# EAGLE schematic mega bootloader (EAGLE 7.6.0)
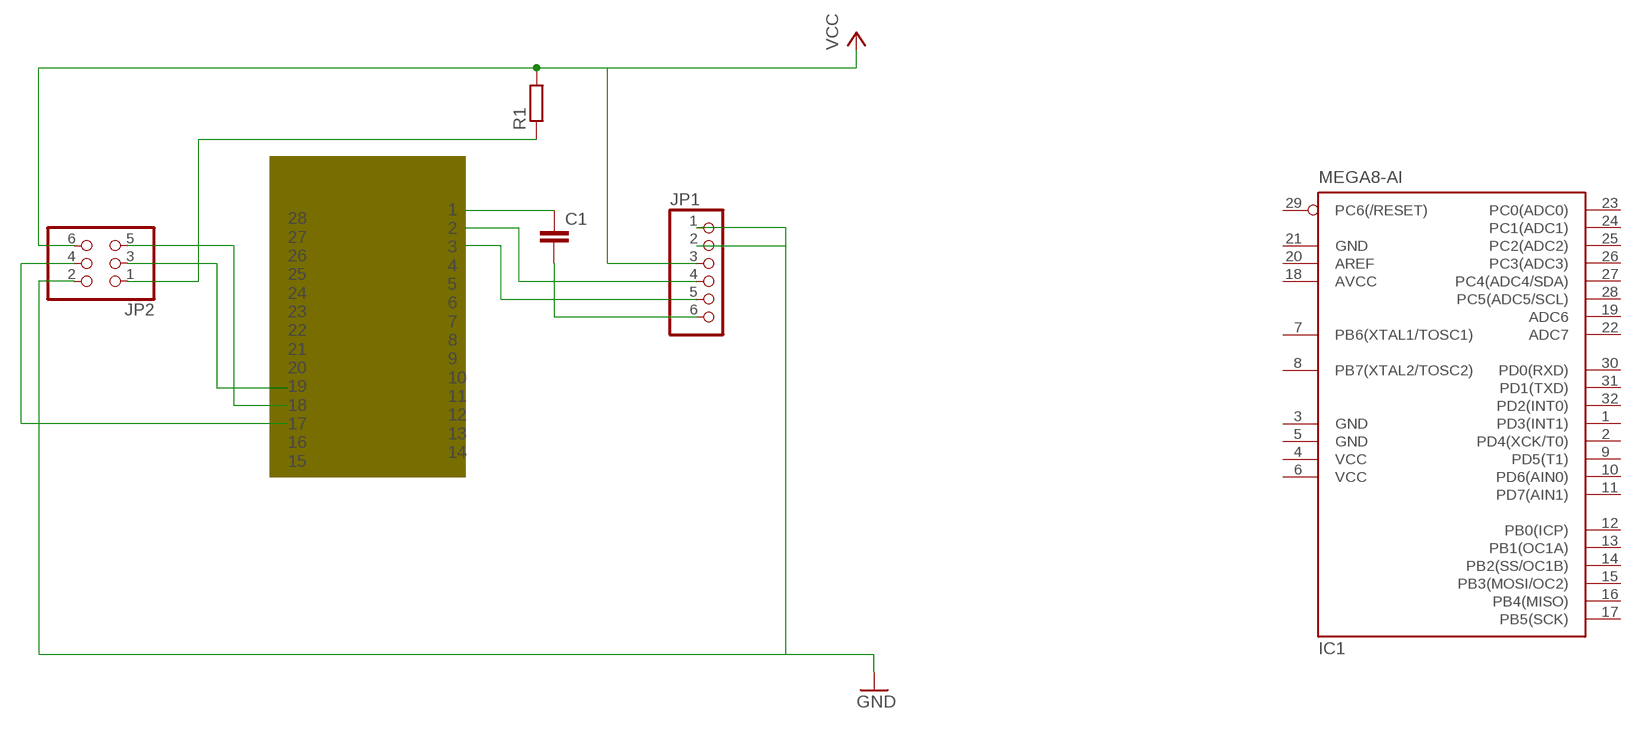
[diagram p0: schematic, sheet 1]

## Parts
C1  C-EU025-024X044  [C025-024X044]
IC1  MEGA8-AI  [TQFP32-08]
JP1  PINHD-1X6  [1X06]
JP2  PINHD-2X3  [2X03]
R1  R-EU_0204/2V  [0204V]

## Nets
GND: JP2.2
N$1: C1.2
N$2: C1.1
N$3: JP2.4
N$4: JP2.5
N$5: JP2.3
N$6: JP2.1 R1.1
VCC: JP2.6 R1.2
Unconnected: IC1.1(PD3(INT1)) IC1.2(PD4(XCK/T0)) IC1.7(PB6(XTAL1/TOSC1)) IC1.8(PB7(XTAL2/TOSC2)) IC1.9(PD5(T1)) IC1.10(PD6(AIN0)) IC1.11(PD7(AIN1)) IC1.12(PB0(ICP)) IC1.13(PB1(OC1A)) IC1.14(PB2(SS/OC1B)) IC1.15(PB3(MOSI/OC2)) IC1.16(PB4(MISO)) IC1.17(PB5(SCK)) IC1.19(ADC6) IC1.20(AREF) IC1.22(ADC7) IC1.23(PC0(ADC0)) IC1.24(PC1(ADC1)) IC1.25(PC2(ADC2)) IC1.26(PC3(ADC3)) IC1.27(PC4(ADC4/SDA)) IC1.28(PC5(ADC5/SCL)) IC1.29(PC6(/RESET)) IC1.30(PD0(RXD)) IC1.31(PD1(TXD)) IC1.32(PD2(INT0)) JP1.1 JP1.2 JP1.3 JP1.4 JP1.5 JP1.6

## Notes on the sheet
- 1
  2
  3
  4
  5
  6
  7
  8
  9
  10
  11
  12
  13
  14
- 28
  27
  26
  25
  24
  23
  22
  21
  20
  19
  18
  17
  16
  15

## Power pins joined to a net without a drawn wire
AVCC: IC1.18(AVCC)
GND: IC1.3(GND) IC1.5(GND) IC1.21(GND)
VCC: IC1.4(VCC) IC1.6(VCC)

## Library data of the parts
C1 = resistor:C-EU: CAPACITOR, European symbol
IC1 = atmel:MEGA8: MICROCONTROLLER 8 Kbytes FLASH, 1 kbytes SRAM, 512 bytes EEPROM, USART, 6-channel 10 bit ADC, 2-channel 8 bit ADC Pin compatible with Atmega48, ATMega88, ATMega168 Source: avr.lbr; MPN: ATMEGA8-16AU; OC_FARNELL: 9171371; OC_NEWARK: 73M8863
JP1 = pinhead:PINHD-1X6: PIN HEADER
JP2 = pinhead:PINHD-2X3: PIN HEADER
R1 = resistor:R-EU_: RESISTOR, European symbol